# Altium schematic sheet MCU.SchDoc
size A4; SheetNumber: 1; SheetTotal: 2
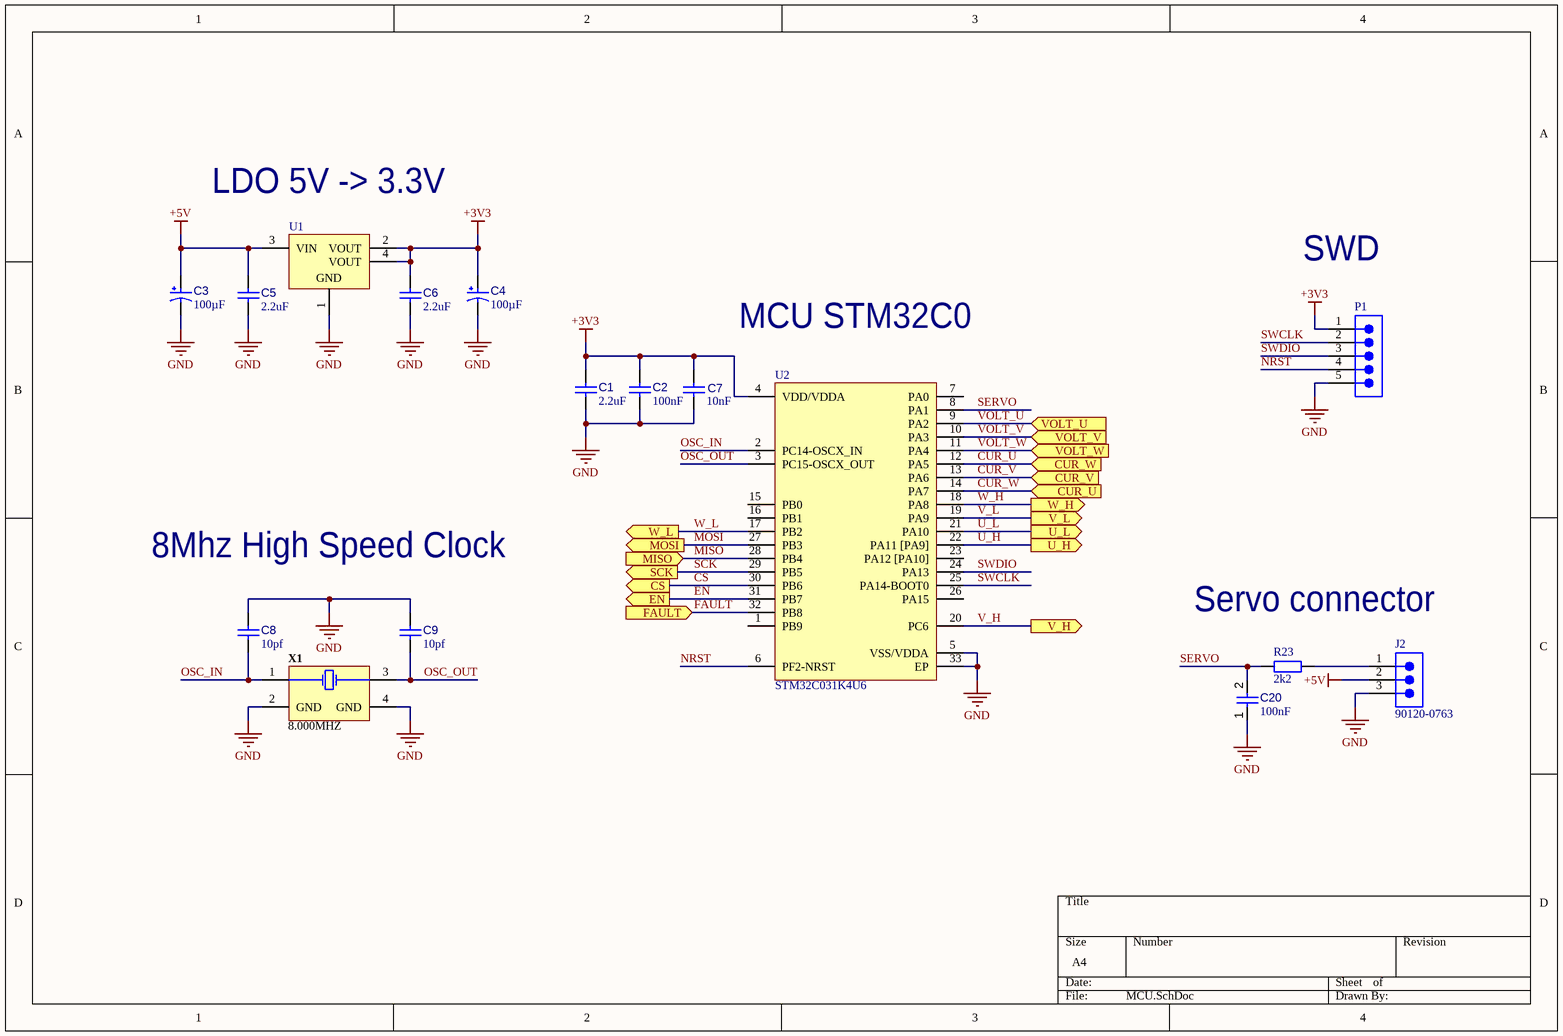
[diagram p0: MCU.SchDoc]

## Parts
C1  value 2.2uF  [CAPC1608X90X40NL10T20]  (hidden comment: Capacitor 100 nF +/-10% 50 V 0603)
C2  value 100nF  [CAPC1608X90X40NL10T20]  (hidden comment: Capacitor 100 nF +/-10% 50 V 0603)
C3  value 100µF  [PNSC-6TPE150MAZB_L]  (hidden comment: Capacitor 150µF +/-20% 6.3V B2)
C4  value 100µF  [PNSC-6TPE150MAZB_L]  (hidden comment: Capacitor 150µF +/-20% 6.3V B2)
C5  value 2.2uF  [CAPC1608X90X40NL10T20]  (hidden comment: Capacitor 100 nF +/-10% 50 V 0603)
C6  value 2.2uF  [CAPC1608X90X40NL10T20]  (hidden comment: Capacitor 100 nF +/-10% 50 V 0603)
C7  value 10nF  [CAPC1608X90X40NL10T20]  (hidden comment: Capacitor 100 nF +/-10% 50 V 0603)
C8  value 10pf  [CAPC1608X90X40NL10T20]  (hidden comment: Capacitor 100 nF +/-10% 50 V 0603)
C9  value 10pf  [CAPC1608X90X40NL10T20]  (hidden comment: Capacitor 100 nF +/-10% 50 V 0603)
C20  value 100nF  [CAPC1608X90X40NL10T20]  (hidden comment: Capacitor 100 nF +/-10% 50 V 0603)
J2  90120-0763  [FP-90120-0763-MFG]
P1  61300511121  [61300511121]  (value not drawn)
R23  value 2k2  [RESC1608X04M]  (hidden comment: R0603)
U1  LD1117S33TR  [STM-SOT-223_M]  (value not drawn)
U2  STM32C031K4U6  [QFN50P500X500X60_HS-33N]
X1  8.000MHZ  [ABRA-ABM3B_V]

## Ports
CS (out, see Mosfet driver[1B]), CUR_U (in, see Mosfet driver[1C]), CUR_V (in, see Mosfet driver[1C]), CUR_W (in, see Mosfet driver[1C]), EN (out, see Mosfet driver[1B]), FAULT (in, see Mosfet driver[1C]), MISO (in, see Mosfet driver[1B]), MOSI (out, see Mosfet driver[1B]), SCK (out, see Mosfet driver[1B]), U_H (out, see Mosfet driver[1C]), U_L (out, see Mosfet driver[1C]), V_H (out, see Mosfet driver[1C]), V_L (out, see Mosfet driver[1C]), VOLT_U (in, see Mosfet driver[4C]), VOLT_V (in, see Mosfet driver[4C]), VOLT_W (in, see Mosfet driver[4C]), W_H (out, see Mosfet driver[1C]), W_L (out, see Mosfet driver[1C])

## Nets
+3V3: C1.2 C2.2 C4.1 C6.2 C7.2 P1.1 U1.2(VOUT) U1.4(VOUT) U2.4(VDD/VDDA)
+5V: C3.1 C5.2 J2.2 U1.3(VIN)
GND: C1.1 C2.1 C3.2 C4.2 C5.1 C6.1 C7.1 C8.2 C9.2 C20.1 J2.3 P1.5 U1.1(GND) U2.5(VSS/VDDA) U2.33(EP) X1.2(GND) X1.4(GND)
CS: U2.30(PB6) ; port CS
CUR_U: U2.12(PA5) ; port CUR_W
CUR_V: U2.13(PA6) ; port CUR_V
CUR_W: U2.14(PA7) ; port CUR_U
EN: U2.31(PB7) ; port EN
FAULT: U2.32(PB8) ; port FAULT
MISO: U2.28(PB4) ; port MISO
MOSI: U2.27(PB3) ; port MOSI
NRST: P1.4 U2.6(PF2-NRST)
OSC_IN: C8.1 U2.2(PC14-OSCX_IN) X1.1(X1)
OSC_OUT: C9.1 U2.3(PC15-OSCX_OUT) X1.3(X2)
SCK: U2.29(PB5) ; port SCK
SERVO: C20.2 R23.2 U2.8(PA1)
SWCLK: P1.2 U2.25(PA14-BOOT0)
SWDIO: P1.3 U2.24(PA13)
U_H: U2.22(PA11_[PA9]) ; port U_H
U_L: U2.21(PA10) ; port U_L
V_H: U2.20(PC6) ; port V_H
V_L: U2.19(PA9) ; port V_L
VOLT_U: U2.9(PA2) ; port VOLT_U
VOLT_V: U2.10(PA3) ; port VOLT_V
VOLT_W: U2.11(PA4) ; port VOLT_W
W_H: U2.18(PA8) ; port W_H
W_L: U2.17(PB2) ; port W_L
NetJ2_1: J2.1 R23.1

Not connected (* = marked no-connect by the designer): U2 1(PB9) 7(PA0) 15(PB0) 16(PB1) 23(PA12_[PA10]) 26(PA15)

## Notes on the sheet
- (near U1) LDO 5V -> 3.3V
- SWD
- MCU STM32C0
- 8Mhz High Speed Clock
- Servo connector

## Library data of the parts
C1 C2 C5-C9 C20 = CMP-001-00017-6: Chip Capacitor, 100 nF, +/- 10%, 50 V, 0603 (1608 Metric); Voltage Rating: 50V; Capacitor Type: Ceramic; Tolerance: 10%; Mounting Technology: SM; Max Operating Temperature: 125°C; RoHS Compliant: True; Pins: 2; Case/Package: 0603; Min Operating Temperature: -55°C
C3 C4 = CMP-001-00053-3: Molded Tantalum Polymer Capacitor, 150 uF, +/- 20%, 6.3 V, -55 to 105 degC, 2-Pin SMD, RoHS, Tape and Reel; Pins: 2; Tolerance: 20%; Max Operating Temperature: 105°C; Mounting Technology: SMT; Min Operating Temperature: -55°C; Voltage Rating: 6.3V; Case/Package: 2917
J2 = CMP-002-00071-1: Board Connector, 3 Contact(s), 1 Row(s), Male, Straight, 0.1 inch Pitch, Solder Terminal, Black Insulator, Receptacle; Min Operating Temperature: -55°C; Connector Type: BOARD CONNECTOR; Max Operating Temperature: 125°C; RoHS Compliant: Yes; Mounting Technology: Board
P1 = CMP-002-00074-2: Board Connector, 5 Contact(s), 1 Row(s), Male, Straight, 0.1 inch Pitch, Solder Terminal, Locking, Black Insulator, Plug; Min Operating Temperature: -40°C; RoHS Compliant: Yes; Max Operating Temperature: 125°C; Mounting Technology: Board; Connector Type: BOARD CONNECTOR
R23 = CMP-009-00179-11: Resistor SMD 0603
U1 = CMP-019-00019-3: Low Drop Positive Voltage Regulator, 800 mA, Fixed 3.3 V Output, 0 to 125 degC, 3-Pin TO-220, RoHS, Tape and Reel; Manufacturer: STMicroelectronics; Max Supply Voltage: 15V; Dropout Voltage: 1.1V; Power: 12W; Output Current: 950mA; Min Input Voltage: 4.75V; Nominal Output Voltage: 3.3V; Max Ouput Current: 1.3A; Outputs: 1; Packaging: TapeandReel; Datasheet Version: Rev. 33, 11/2013; RoHS Compliant: True; Mounting Technology: SM; Max Input Voltage: 15V; Max Operating Temperature: 125°C; Package Reference: SOT-223; Package Quantity: 2500; Package Description: 4-Pin Small Outline Transistor, Body 6.5 x 3.5 mm, Pitch 2.3 mm; Case/Package: TO-261-4; Min Operating Temperature: 0°C; Datasheet URL: http://www.farnell.com/datasheets/1776449.pdf; Min Supply Voltage: 4.75V; Pins: 3; Output Voltage: 3.3V; Manufacturer URL: http://www.st.com/
U2 = CMP-020-00024-2: ARM Cortex-M0+ 32-bit MCU, 32 KB Flash, 12 KB RAM, 2 x USART, timers, ADC, comm. I/Fs, 2-3.6 V; Nominal Supply Voltage: 3.3V; I/Os: 30; Clock Frequency: 48MHz; Mounting Technology: SMT; Case/Package: UFQFPN32
X1 = CMP-003-00021-2: Ceramic SMD Crystal, 8 MHz, +/- 20 ppm, 18 pF, -20 to 70 degC, 4-Pin SMD, RoHS, Tape and Reel; Manufacturer: Abracon; Resistance: 200Ohm; ESR: 200; Tolerance: 20ppm; Frequency: 8MHz; Load Capacitance: 18pF; Mounting Technology: SM; Case/Package: CSMD; Pins: 4; Datasheet Version: Aug-15; Datasheet URL: http://www.abracon.com/Resonators/abm3b.pdf; Manufacturer URL: http://www.abracon.com/; Package Quantity: 1000; Package Description: 4-Pin Surface Mount Device, Body 5 x 3.2 mm; Package Reference: ABM3B; Min Operating Temperature: -20°C; Max Operating Temperature: 70°C; Packaging: TapeandReel; Frequency Tolerance: 20ppm; RoHS Compliant: True